# Altium schematic sheet PreCharge.SchDoc
size A4; SheetNumber: 8; SheetTotal: 8
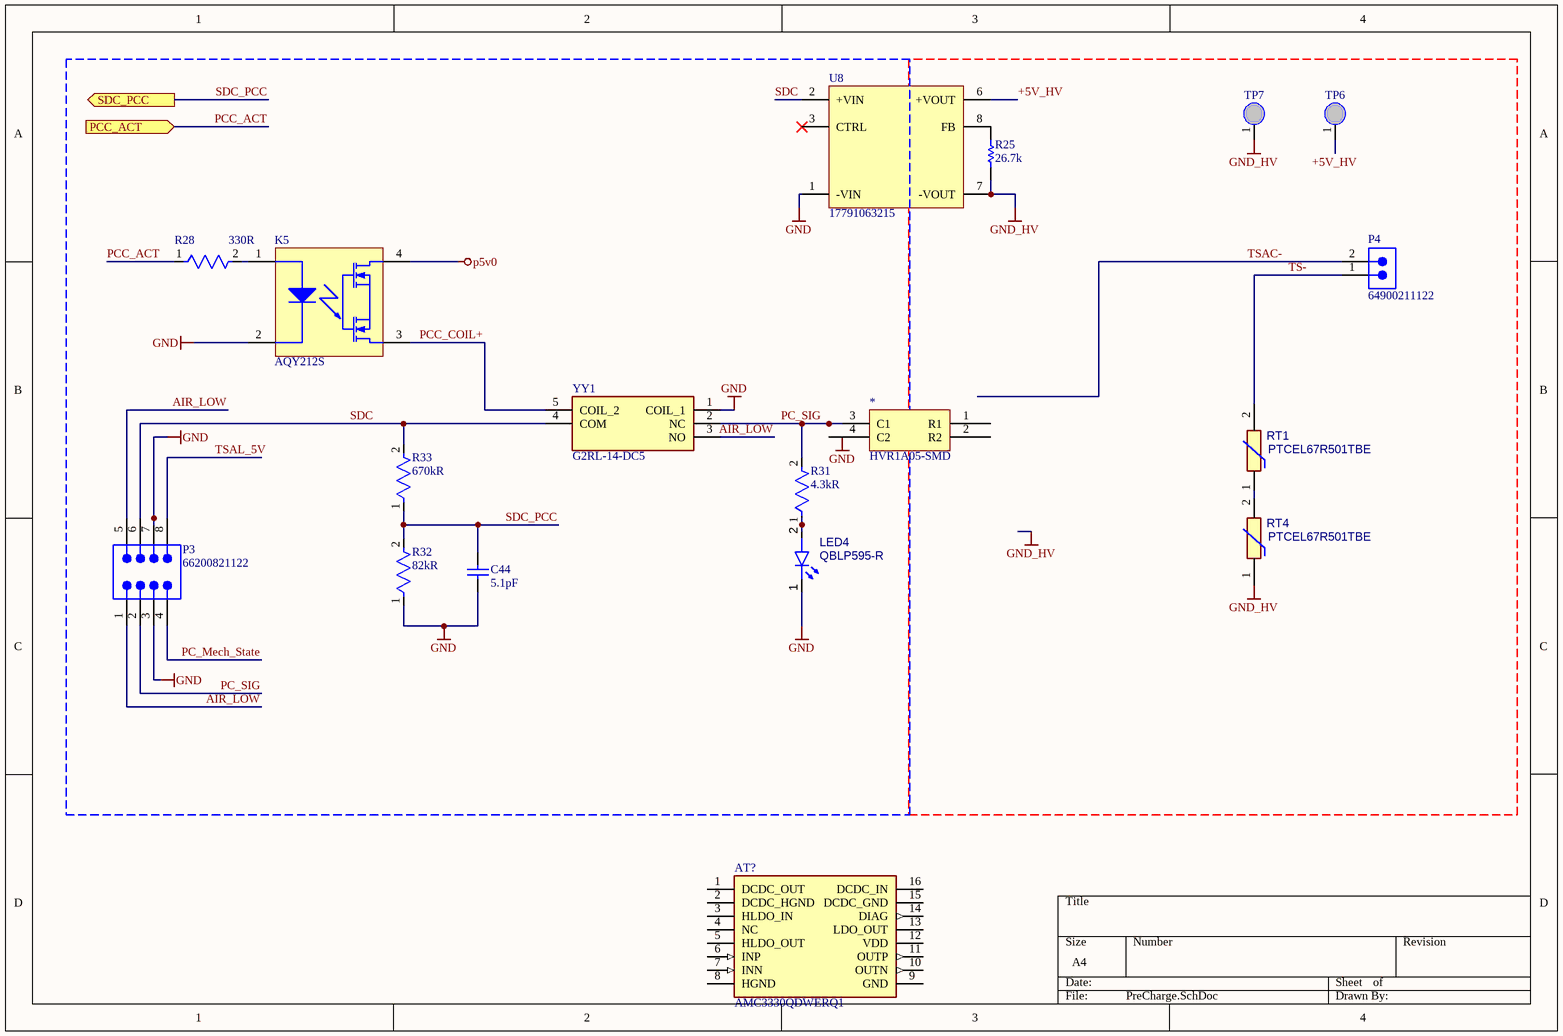
[diagram p0: PreCharge.SchDoc]

## Parts
*  HVR1A05-SMD  [HVR1A05-SMD]
AT?  AMC3330QDWERQ1  [SOIC127P1030X265-16N]
C44  value 5.1pF  [WCAP-CSGP_0402_L1W0.5H0.5]  (hidden comment: CAP 0402 5.1pF X7R)
K5  AQY212S  [PNSC-SOP4_V]
LED4  QBLP595-R  [QTB-QBLP595_V]
P3  66200821122  [66200821122]
P4  64900211122  [64900211122]
R25  26.7k  [RESC1608X55X30ML15T15]
R28  value 330R  [FP-ERA3A-MFG]  (hidden comment: 8.2kR)
R31  value 4.3kR  [RES_SM0603_YAGEORC_N]  (hidden comment: RES 0603 4.3kR 1%)
R32  value 82kR  [RES_SM0603_YAGEORC_N]  (hidden comment: 2.7kR)
R33  value 670kR  [RES_SM0603_YAGEORC_N]  (hidden comment: 20kR)
RT1  PTCEL67R501TBE  [PTCEL67R501TBE-Footprint-1]
RT4  PTCEL67R501TBE  [PTCEL67R501TBE-Footprint-1]
TP6  GTT_ProbeerPunt  [GTT_ProbeerPuntFP]  (value not drawn)  (no BOM)
TP7  GTT_ProbeerPunt  [GTT_ProbeerPuntFP]  (value not drawn)  (no BOM)
U8  17791063215  [WPME-VISM_SIP-8_L21.8W9.2H11.1]
YY1  G2RL-14-DC5  [G2RL14DC12]

## Ports
PCC_ACT (in), SDC_PCC (out)

## Nets
GND: C44.1 K5.2 LED4.1(K) P3.3 P3.7 R32.1 U8.1(-VIN) YY1.1(COIL_1)
GND_HV: R25.2 RT4.1 TP7.1 U8.7(-VOUT)
p5v0: K5.4
+5V_HV: TP6.1 U8.6(+VOUT)
AIR_LOW: P3.1 P3.5 YY1.3(NO)
PC_Mech_State: P3.4
PC_SIG: *.3(C1) P3.2 R31.2 YY1.2(NC)
PCC_ACT: R28.1 ; port PCC_ACT
PCC_COIL+: K5.3 YY1.5(COIL_2)
SDC: P3.6 R33.2 U8.2(+VIN) YY1.4(COM)
SDC_PCC: C44.2 R32.2 R33.1 ; port SDC_PCC
TS-: P4.1 RT1.2
TSAC-: P4.2
TSAL_5V: P3.8
NetK5_1: K5.1 R28.2
NetLED4_2: LED4.2(A) R31.1
NetR25_1: R25.1 U8.8(FB)
NetRT1_1: RT1.1 RT4.2

Not connected (* = marked no-connect by the designer): * 1(R1) 2(R2) 4(C2); AT? 1(DCDC_OUT) 2(DCDC_HGND) 3(HLDO_IN) 4(NC) 5(HLDO_OUT) 6(INP) 7(INN) 8(HGND) 9(GND) 10(OUTN) 11(OUTP) 12(VDD) 13(LDO_OUT) 14(DIAG) 15(DCDC_GND) 16(DCDC_IN); U8 3(CTRL)*

## Notes on the sheet
- Labels drawn without touching a wire or pin: GND

## Library data of the parts
AT? = AMC3330QDWERQ1: Attenuator or Isolator; Manufacturer_Name: Texas Instruments; Datasheet Link: https://www.ti.com/lit/ds/symlink/amc3330.pdf?ts=1605812770714&ref_url=https%253A%252F%252Fwww.ti.com%252Fsitesearch%252Fdocs%252Funiversalsearch.tsp%253FsearchTerm%253DAMC3330DWE; Height: 2.65mm; Manufacturer_Part_Number: AMC3330QDWERQ1; Mouser Part Number: 595-AMC3330QDWERQ1; Mouser Price/Stock: https://www.mouser.co.uk/ProductDetail/Texas-Instruments/AMC3330QDWERQ1?qs=81r%252BiQLm7BThq9fK1XpIYg%3D%3D; Arrow Part Number: AMC3330QDWERQ1; Arrow Price/Stock: https://www.arrow.com/en/products/amc3330qdwerq1/texas-instruments?utm_currency=USD&region=nac
C44 = CMP-001-01308-5: GTT Standard 0402 non-polarized capacitor; Pins: 2; Case/Package: 0402; Category: Multilayer Ceramic Chip Capacitors; Ceramic Type: X7R
K5 = CMP-1340-00001-2: PhotoMOS GU SOP 1 Form A, 60 V Load Voltage, 0.5 A Continuous Load Current, -40 to 85 degC, 4-Pin SOP, Tube, RoHS; Manufacturer: Panasonic; Pb-Free: True; Load Voltage: 60 V; On Resistance (Typ): 0.83 Ohm; Continuous Load Current: 0.5 A; PackageVersion: ASCTB67E, 04/2014; DatasheetVersion: 201404-T; PackageDescription: 4-Pin Small Outline Package, Body 4.4 x 4.3 mm, Pitch 2.54 mm; Mounting Technology: Surface Mount; ComponentLink1URL: http://www3.panasonic.biz/ac/ae/index.jsp; ComponentLink3Description: Package Specification; Series: PhotoMOS GU SOP 1 Form A; PackageReference: SOP4; PartNumber: AQY212S; ComponentLink2URL: http://www3.panasonic.biz/ac/e_download/control/relay/photomos/catalog/semi_eng_gu1a_aqy21_s.pdf?f_cd=301142; ComponentLink1Description: Manufacturer URL; Packing: Tube; ComponentLink3URL: http://www3.panasonic.biz/ac/e_download/control/relay/photomos/catalog/semi_eng_dimensions.pdf?f_cd=401560; ComponentLink2Description: Datasheet; RoHS: True
LED4 = CMP-007-00040-2: Chip LED 0402, Red, 0.02 A, 2.0 to 2.5 V, -40 to 80 degC, 2-Pin SMD, RoHS, Tape and Reel; Colour: Red; Case/Package: 0402; RoHS Compliant: Yes; Pins: 2; Mounting Technology: SMT
P3 = CMP-1502-00311-2: NexarPartId: 22865258; Operating Supply Voltage: 250V; Contact Resistance: 10mΩ; Row Spacing: 2.9972mm; Number of Contacts: 8; Gender: Male; Insulation: Insulated; Connector Type: Male Pin, Socket; Pitch: 3mm; Current Rating: 5A; Insulation Resistance: 1GΩ; Contact Material: Copper; Contact Plating: Tin; Number of Rows: 2; Height: 9.9mm; Fastening Type: Ramp; Mount: Through Hole; Lead Pitch: 3mm; Housing Material: Nylon; Termination: Through Hole; RoHS: Compliant; Min Operating Temperature: -40°C; Orientation: Vertical; Contact Gender: Male; Width: 15.7mm; Number of Positions: 8; REACH SVHC: Unknown; Max Operating Temperature: 105°C; Number of Pins: 8; Color: Black; Flammability Rating: UL94 V-0; Voltage Rating: 250V; Length: 15.7mm
P4 = CMP-1502-00552-2: NexarPartId: 23024593; Number of Contacts: 2; Operating Supply Voltage: 600V; Gender: Male; Pitch: 4.2mm; Insulation Resistance: 1GΩ; Current Rating: 9A; Contact Resistance: 10mΩ; Connector Type: Male Pin, Plug; Lead Pitch: 4.2mm; Width: 13.8mm; Max Operating Temperature: 105°C; Termination: Solder; Orientation: Vertical; Mount: Through Hole; Contact Plating: Tin; Number of Pins: 2; Color: White; Number of Rows: 1; Min Operating Temperature: -40°C; Fastening Type: Ramp; Number of Positions: 2; REACH SVHC: Unknown; Height: 12.8mm; RoHS: Compliant; Contact Material: Copper; Length: 9.6mm; ClassName: HV
R25 = CMP-2000-00385-1: Part Number: ERJ-3EKF2672V; Manufacturer: Panasonic; ClassName: HV
R28 R32 R33 = CMP-009-00206-2: GTT Standard 0603 Resistor; Voltage Rating: 50V; Power: 62.5mW; Tolerance: 1%; Case/Package: 0603; Mounting Technology: SMD
R31 = CMP-009-00206-2: GTT Standard 0603 Resistor; Voltage Rating: 50V; Power: 62.5mW; Case/Package: 0603; Tolerance: 1%; Mounting Technology: SMD
RT1 RT4 = CMP-009-00210-4: VISHAY - PTCEL67R501TBE - PTC THERMISTOR; R25 value: 500 Ohms; Value: 500; Voltage Rating: 1.2kV; Pins: 2; RoHS Compliant: yes; Min Operating Temperature: -40°C; Mounting Technology: Through hole mount; Max Operating Temperature: 105°C; ComponentLink1Description: Datasheet; ComponentLink1URL: https://www.vishay.com/docs/29207/ptcel_highenergy-series.pdf; ClassName: HV
TP6 TP7 = CMP-00030-00001-6: Design Item ID: GTT_ProbeerPunt; Source: GTT_MainComponentLibrary.SchLib
U8 = CMP-002-000000-1: WPME-VISM Variable Isolated Module, THT, SIP-8, 8-42Vin, 3.3-6Vout; Manufacturer: Wurth Elektronik; Output Voltage Max: 6V; Output Voltage Min: 3.3V; Isolation Voltage: 2000V; Input Voltage Max: 42V; Input Voltage Min: 8V; ComponentLink1URL: https://www.we-online.com/redexpert/article/17791063215?ad; Operating Temperature Min: -40°C; Height: 11.1mm; Component Type: Standard; Manufacturer Part Number: 17791063215; Pin Count: 6; Match Code: WPME-VISM; Operating Temperature Max: 85°C; ComponentLink2Description: Datasheet Link; Case/Size Code: SIP-8; ComponentLink2URL: https://www.we-online.com/redexpert/spec/17791063215?ad; Design Item ID: 17791063215; Width: 9.2mm; ComponentLink1Description: Website Link; Packaging: Tube; Source: WPME-VISM.SchLib; Mount: Through Hole; Length: 21.8mm; Category: Isolated Converter; ClassName: HV
YY1 = G2RL-14-DC5: Relay or Contactor; Manufacturer_Name: Omron Electronics; Datasheet Link: https://www.mouser.com/datasheet/2/307/en-g2rl-472571.pdf; Height: 15.7mm; Manufacturer_Part_Number: G2RL-14-DC5; Mouser Part Number: 653-G2RL-14-DC5; Mouser Price/Stock: https://www.mouser.co.uk/ProductDetail/Omron-Electronics/G2RL-14-DC5?qs=HDDQUw%2F3PhqmQhZT1d%252BPSg%3D%3D; Arrow Part Number: G2RL-14-DC5; Arrow Price/Stock: https://www.arrow.com/en/products/g2rl14dc5/omron?region=nac
* = HVR1A05-SMD: ComponentLink1Description: Datasheet; ComponentLink1URL: https://jlcpcb.com/api/file/downloadByFileSystemAccessId/8603384602715443200